# Altium schematic sheet Aixcel_Tiny_Recon_Board_Page1.SchDoc
size A4; Organization: Altium Limited; Address1: L3, 12a Rodborough Rd; Address2: Frenchs Forest; Address3: NSW; Address4: Australia 2086; DocumentNumber: 01; Revision: 01; SheetNumber: 3; SheetTotal: 4
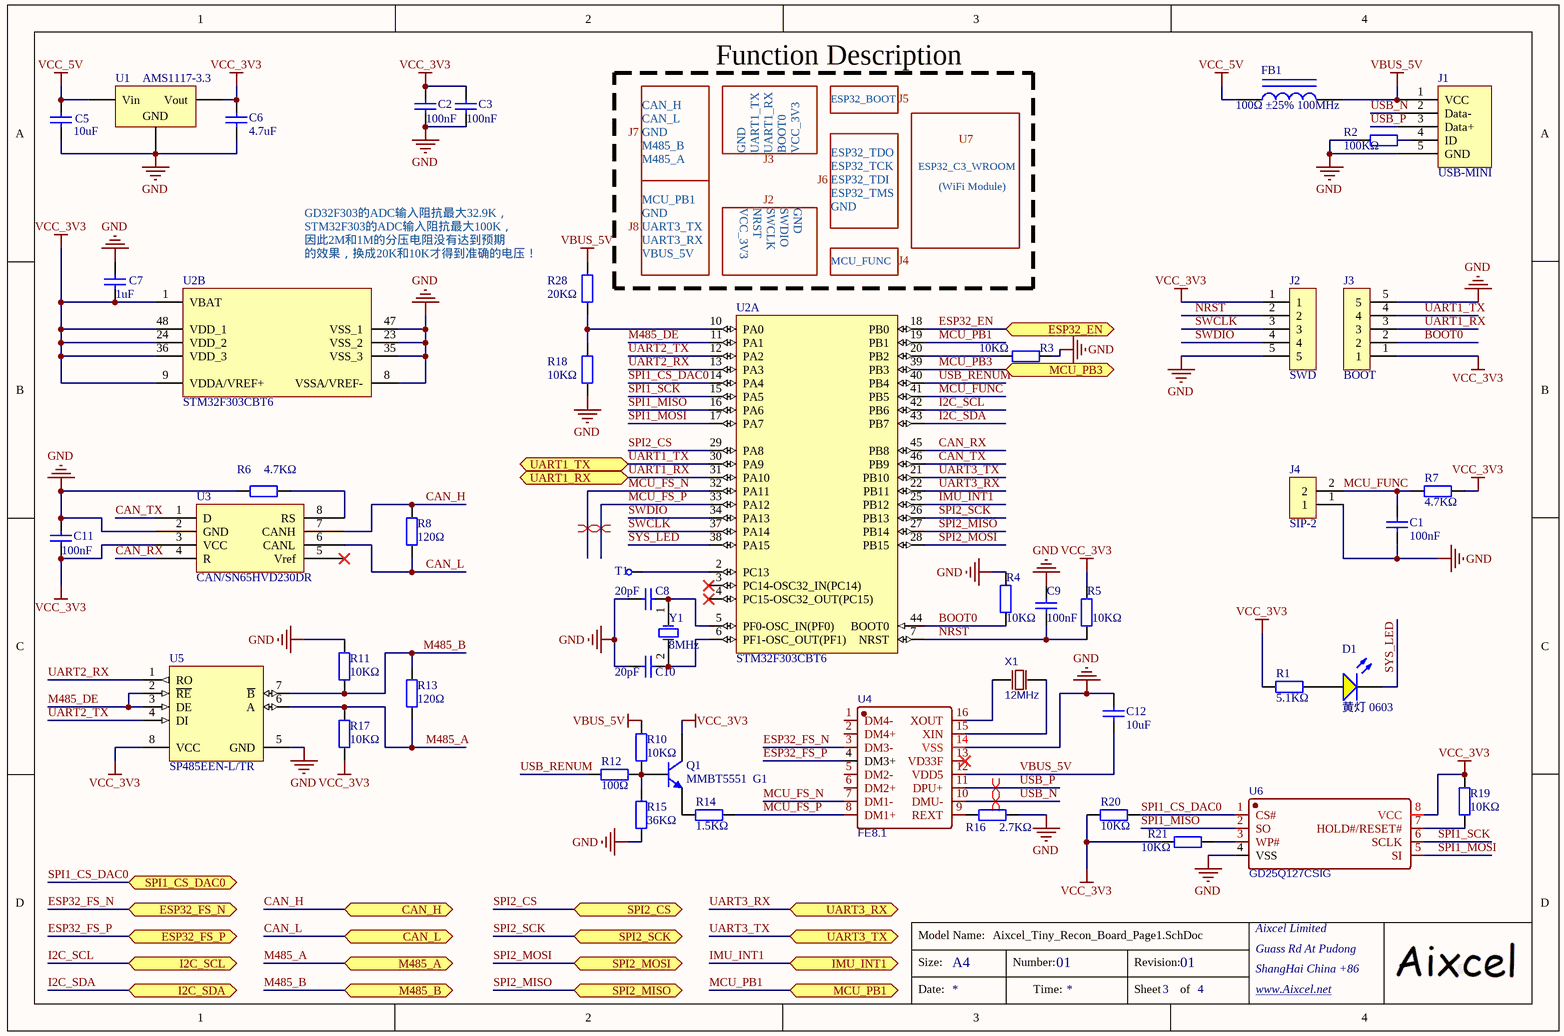
[diagram p0: Aixcel_Tiny_Recon_Board_Page1.SchDoc]

## Parts
C1  100nF  [0603_C]
C2  100nF  [0603_C]
C3  100nF  [0603_C]
C5  10uF  [0603_C]
C6  4.7uF  [0603_C]
C7  1uF  [0603_C]
C8  20pF  [0603_C]
C9  100nF  [0603_C]
C10  20pF  [0603_C]
C11  100nF  [0603_C]
C12  10uF  [0603_C]
D1  黄灯 0603  [0603_LED_S1]
FB1  100Ω ±25% 100MHz  [0805_L]
J1  USB-MINI  [USB-MINI贴片]
J2  SWD  [ZH1.5-WS-5P]
J3  BOOT  [ZH1.5-WS-5P]
J4  SIP-2  [TSW SMD-3*6*2.5]
Q1  MMBT5551  G1  [SOT-23(SOT-23-3)]
R1  5.1KΩ  [0603_R]
R2  100KΩ  [0603_R]
R3  10KΩ  [0603_R]
R4  10KΩ  [0603_R]
R5  10KΩ  [0603_R]
R6  4.7KΩ  [0603_R]
R7  4.7KΩ  [0603_R]
R8  120Ω  [0603_R]
R10  10KΩ  [0603_R]
R11  10KΩ  [0603_R]
R12  100Ω  [0603_R]
R13  120Ω  [0603_R]
R14  1.5KΩ  [0603_R]
R15  36KΩ  [0603_R]
R16  2.7KΩ  [0603_R]
R17  10KΩ  [0603_R]
R18  10KΩ  [0603_R]
R19  10KΩ  [0603_R]
R20  10KΩ  [0603_R]
R21  10KΩ  [0603_R]
R28  20KΩ  [0603_R]
T1  CHECK  [CHECK-C]  (value not drawn)
U1  AMS1117-3.3  [SOT-223]
U2  STM32F303CBT6  [STM-LQFP48_L]  (parts A,B of 2)
U3  CAN/SN65HVD230DR  [SOIC-8_150mil]
U4  FE8.1  [SSOP-16_L4.9-W3.9-P0.64-LS6.0-BL]
U5  SP485EEN-L/TR  [SOIC-8_150mil]
U6  GD25Q127CSIG  [GD25Q127CSIG]
X1  12MHz  [12MHz]
Y1  8MHz  [SMD-5032_2P]

## Ports
CAN_H (bidir), CAN_L (bidir), ESP32_EN (bidir), ESP32_FS_N (bidir), ESP32_FS_P (bidir), I2C_SCL (bidir), I2C_SDA (bidir), IMU_INT1 (bidir), M485_A (bidir), M485_B (bidir), MCU_PB1 (bidir), MCU_PB3 (bidir), SPI1_CS_DAC0 (bidir), SPI2_CS (bidir), SPI2_MISO (bidir), SPI2_MOSI (bidir), SPI2_SCK (bidir), UART1_RX (bidir), UART1_TX (bidir), UART3_RX (bidir), UART3_TX (bidir)

## Nets
GND: C1.1 C2.2 C3.2 C5.1 C6.1 C7.2 C8.1 C9.2 C10.1 C11.2 C12.2 J1.5(GND) J2.5 J3.5 J4.1 R2.1 R3.1 R4.2 R6.1 R11.2 R15.1 R16.2 R18.1 U1.1(GND) U2.8(VSSA/VREF-) U2.23(VSS_2) U2.35(VSS_3) U2.47(VSS_1) U3.2(GND) U4.14(VSS) U5.5(GND) U6.4(VSS)
VBUS_5V: C12.1 FB1.2 J1.1(VCC) R10.2 R28.2 U4.12(VDD5)
VCC_3V3: C2.1 C3.1 C6.2 C7.1 C11.1 J2.1 J3.1 Q1.3(C) R1.1 R5.2 R7.2 R17.1 R19.1 R20.1 R21.2 U1.2(Vout) U2.1(VBAT) U2.9(VDDA/VREF+) U2.24(VDD_2) U2.36(VDD_3) U2.48(VDD_1) U3.3(VCC) U5.8(VCC) U6.8(VCC)
VCC_5V: C5.2 FB1.1 U1.3(Vin)
BOOT0: J3.2 R4.1 U2.44(BOOT0)
CAN_H: R8.2 U3.7(CANH) ; port CAN_H
CAN_L: R8.1 U3.6(CANL) ; port CAN_L
CAN_RX: U2.45(PB8) U3.4(R)
CAN_TX: U2.46(PB9) U3.1(D)
ESP32_EN: U2.18(PB0) ; port ESP32_EN
ESP32_FS_N: U4.3(DM3-) ; port ESP32_FS_N
ESP32_FS_P: U4.4(DM3+) ; port ESP32_FS_P
I2C_SCL: U2.42(PB6) ; port I2C_SCL
I2C_SDA: U2.43(PB7) ; port I2C_SDA
IMU_INT1: U2.25(PB12) ; port IMU_INT1
M485_A: R13.1 R17.2 U5.6(A) ; port M485_A
M485_B: R11.1 R13.2 U5.7(~{B}) ; port M485_B
M485_DE: U2.11(PA1) U5.2(~{RE}) U5.3(DE)
MCU_FS_N: U2.32(PA11) U4.7(DM1-)
MCU_FS_P: R14.1 U2.33(PA12) U4.8(DM1+)
MCU_FUNC: C1.2 J4.2 R7.1 U2.41(PB5)
MCU_PB1: U2.19(PB1) ; port MCU_PB1
MCU_PB3: U2.39(PB3) ; port MCU_PB3
NRST: C9.1 J2.2 R5.1 U2.7(NRST)
SPI1_CS_DAC0: R20.2 U2.14(PA4) U6.1(CS#) ; port SPI1_CS_DAC0
SPI1_MISO: U2.16(PA6) U6.2(SO)
SPI1_MOSI: U2.17(PA7) U6.5(SI)
SPI1_SCK: U2.15(PA5) U6.6(SCLK)
SPI2_CS: U2.29(PA8) ; port SPI2_CS
SPI2_MISO: U2.27(PB14) ; port SPI2_MISO
SPI2_MOSI: U2.28(PB15) ; port SPI2_MOSI
SPI2_SCK: U2.26(PB13) ; port SPI2_SCK
SWCLK: J2.3 U2.37(PA14)
SWDIO: J2.4 U2.34(PA13)
SYS_LED: D1.K U2.38(PA15)
UART1_RX: J3.3 U2.31(PA10) ; port UART1_RX
UART1_TX: J3.4 U2.30(PA9) ; port UART1_TX
UART2_RX: U2.13(PA3) U5.1(RO)
UART2_TX: U2.12(PA2) U5.4(DI)
UART3_RX: U2.22(PB11) ; port UART3_RX
UART3_TX: U2.21(PB10) ; port UART3_TX
USB_N: J1.2(Data-) U4.10(DMU-)
USB_P: J1.3(Data+) U4.11(DPU+)
USB_RENUM: R12.1 U2.40(PB4)
NetC8_2: C8.2 U2.5(PF0-OSC_IN(PF0)) Y1.1(OSC1)
NetC10_2: C10.2 U2.6(PF1-OSC_OUT(PF1)) Y1.2(OSC2)
NetD1_A: D1.A R1.2
NetJ1_4: J1.4(ID) R2.2
NetQ1_1: Q1.1(B) R10.1 R12.2 R15.2
NetQ1_2: Q1.2(E) R14.2
NetR3_2: R3.2 U2.20(PB2)
NetR6_2: R6.2 U3.8(RS)
NetR16_1: R16.1 U4.9(REXT)
NetR18_2: R18.2 R28.1 U2.10(PA0)
NetR19_2: R19.2 U6.7(HOLD#/RESET#)
NetR21_1: R21.1 U6.3(WP#)
NetT1_1: T1.1 U2.2(PC13)
NetU4_15: U4.15(XIN) X1.2(OSC2)
NetU4_16: U4.16(XOUT) X1.1(OSC1)

Not connected (* = marked no-connect by the designer): U2 3(PC14-OSC32_IN(PC14))* 4(PC15-OSC32_OUT(PC15))*; U3 5(Vref)*; U4 1(DM4-) 2(DM4+) 5(DM2-) 6(DM2+) 13(VD33F)*

## Layout directives
differential pair: MCU_FS_N, MCU_FS_P, USB_N, USB_P

## Notes on the sheet
- CAN_H
- Function Description
- ESP32_BOOT
- J5
- J7
- M485_A
- M485_B
- CAN_L
- GND
- J3
- UART1_TX
- UART1_RX
- BOOT0
- VCC_3V3
- ESP32_TDO
- ESP32_TCK
- ESP32_C3_WROOM
- U7
- GD32F303的ADC输入阻抗最大32.9K，
- STM32F303的ADC输入阻抗最大100K，
- 因此2M和1M的分压电阻没有达到预期
- J8
- UART3_RX
- UART3_TX
- MCU_PB1
- NRST
- J2
- SWCLK
- SWDIO
- J6
- ESP32_TDI
- ESP32_TMS
- (WiFi Module)
- (near U2) 的效果，换成20K和10K才得到准确的电压！
- VBUS_5V
- MCU_FUNC
- J4
- Size:
- Model Name:
- A4
- Number:
- Revision:
- Aixcel Limited
- Guass Rd At Pudong
- ShangHai China +86
- Date:
- Time:
- Sheet
- of
- www.Aixcel.net <http://www.Aixcel.net>

## Library data of the parts
C1-C3 C9 C11 = 0603 100nF (104) 10% 50V: 贴片电容; ComponentLink1Description: 供应商链接; ComponentLink1URL: http://www.szlcsc.com/product/details_15331.html; Package: 0603; Supplier: LC; SuppliersPartNumber: C14663
C5 C12 = 0603 10uF (106) 10% 10V: 贴片电容; ComponentLink1Description: 供应商链接; ComponentLink1URL: http://www.szlcsc.com/product/details_20411.html; Package: 0603; Supplier: LC; SuppliersPartNumber: C19702
C6 = 0603 4.7uF (475) 10% 16V: 贴片电容; ComponentLink1Description: 供应商链接; ComponentLink1URL: http://www.szlcsc.com/product/details_20375.html; Package: 0603; Supplier: LC; SuppliersPartNumber: C19666
C7 = 0603 1uF (105) 10% 50V: 贴片电容; ComponentLink1Description: 供应商链接; ComponentLink1URL: http://www.szlcsc.com/product/details_16531.html; Package: 0603; Supplier: LC; SuppliersPartNumber: C15849
C8 C10 = 0603 20pF (200) 5% 50V: 贴片电容; ComponentLink1Description: 供应商链接; ComponentLink1URL: http://www.szlcsc.com/product/details_2000.html; Package: 0603; Supplier: LC; SuppliersPartNumber: C1648
D1 = 0603 黄灯: 发光二极管; ComponentLink1Description: 供应商链接; ComponentLink1URL: http://www.szlcsc.com/product/details_73147.html; Package: 0603; Supplier: LC; SuppliersPartNumber: C72038
FB1 = 0805 100Ω 25% 100MHz: 贴片磁珠; ComponentLink1Description: 供应商链接; ComponentLink1URL: http://www.szlcsc.com/product/details_1367.html; Package: 0805; Supplier: LC; SuppliersPartNumber: C1015
J2 J3 = SIP-5
Q1 = SOT-23 MMBT5551  G1: 三极管; ComponentLink1Description: 供应商链接; ComponentLink1URL: http://www.szlcsc.com/product/details_2502.html; Package: SOT-23; Supplier: LC; SuppliersPartNumber: C2145
R1 = 0603 5.1KΩ (5101) 1%: 贴片电阻; ComponentLink1Description: 供应商链接; ComponentLink1URL: http://www.szlcsc.com/product/details_23913.html; Package: 0603; Supplier: LC; SuppliersPartNumber: C23186
R2 = 0603 100KΩ (1003) 1%: 贴片电阻; ComponentLink1Description: 供应商链接; ComponentLink1URL: http://www.szlcsc.com/product/details_26546.html; Package: 0603; Supplier: LC; SuppliersPartNumber: C25803
R3-R5 R10 R11 R17-R21 = 0603 10KΩ (1002) 1%: 贴片电阻; ComponentLink1Description: 供应商链接; ComponentLink1URL: http://www.szlcsc.com/product/details_26547.html; Package: 0603; Supplier: LC; SuppliersPartNumber: C25804
R6 R7 = 0603 4.7KΩ (4701) 1%: 贴片电阻; ComponentLink1Description: 供应商链接; ComponentLink1URL: http://www.szlcsc.com/product/details_23889.html; Package: 0603; Supplier: LC; SuppliersPartNumber: C23162
R8 R13 = 0603 120Ω (1200) 1%: 贴片电阻; ComponentLink1Description: 供应商链接; ComponentLink1URL: http://www.szlcsc.com/product/details_23514.html; Package: 0603; Supplier: LC; SuppliersPartNumber: C22787
R12 = 0603 100Ω (1000) 1%: 贴片电阻; ComponentLink1Description: 供应商链接; ComponentLink1URL: http://www.szlcsc.com/product/details_23502.html; Package: 0603; Supplier: LC; SuppliersPartNumber: C22775
R14 = 0603 1.5KΩ (1501) 1%: 贴片电阻; ComponentLink1Description: 供应商链接; ComponentLink1URL: http://www.szlcsc.com/product/details_23570.html; Package: 0603; Supplier: LC; SuppliersPartNumber: C22843
R15 = 0603 36KΩ (3602) 1%: 贴片电阻; ComponentLink1Description: 供应商链接; ComponentLink1URL: http://www.szlcsc.com/product/details_23874.html; Package: 0603; Supplier: LC; SuppliersPartNumber: C23147
R16 = 0603 2.7KΩ (2701) 1%: 贴片电阻; ComponentLink1Description: 供应商链接; ComponentLink1URL: http://www.szlcsc.com/product/details_13814.html; Package: 0603; Supplier: LC; SuppliersPartNumber: C13167
R28 = 0603 20KΩ (2002) 1%: 贴片电阻; ComponentLink1Description: 供应商链接; ComponentLink1URL: http://www.szlcsc.com/product/details_4591.html; Package: 0603; Supplier: LC; SuppliersPartNumber: C4184
T1 = CHECK: 测试点
U1 = SOT-223 AMS1117-3.3: 低压差线性稳压(LDO); ComponentLink1Description: 供应商链接; ComponentLink1URL: http://www.szlcsc.com/product/details_6652.html; Package: SOT-223; Supplier: LC; SuppliersPartNumber: C6186
U2 = STM32F303CBT6: ARM Cortex-M4 32-bit MCU, 128 KB Flash, 32 KB Internal RAM, 37 I/Os, 48-pin LQFP, -40 to 85 degC, Tray; D/A Converter: 2x12-bit (2 Channel); FLASH Size (Prog) (kB): 128; I/Os (High Current): 37; Internal RAM Size (kB): 32; Operating Frequency(F) (Processor speed) (MHz): 72; Supply Voltage(Vcc) min (V): 2; DatasheetVersion: Rev. 6; PackageVersion: Rev. 6, 06/2013; PackageReference: LQFP48; PackageDescription: 48-Pin Low Profile Quad Flat Package, 7 x 7 mm Body, 0.5 mm Pitch; Supplier 1: Digi-Key; Supplier Part Number 1: STM32F303CBT6-ND; Supplier 2: Newark; Supplier Part Number 2: 99W9871; Supplier 3: Newark; Supplier Part Number 3: 66W7285; Core: ARM Cortex-M4; Packing: Tray; Mounting Technology: Surface Mount; PartNumber: STM32F303CBT6; ComponentLink1Description: Manufacturer URL; ComponentLink1URL: http://www.st.com/web/en/home.html; ComponentLink2Description: Datasheet; ComponentLink2URL: http://www.st.com/st-web-ui/static/active/en/resource/technical/document/datasheet/DM00058181.pdf; ComponentLink3Description: Package Specification; ComponentLink3URL: http://www.st.com/st-web-ui/static/active/en/resource/technical/document/datasheet/DM00058181.pdf
U3 = CAN/SN65HVD230DR_[C12084]: CAN; ComponentLink1Description: 供应商链接; ComponentLink1URL: http://www.szlcsc.com/product/details_12661.html; Package: SOIC-8_150mil; Supplier: LC; SuppliersPartNumber: C12084
U4 = FE8.1: Contributor: 私有工程; SMT Type: Extend; BOM_Supplier: zhqsoft; BOM_LCSC Assembly: Yes; spicePre: U; spiceSymbolName: FE8.1
U5 = SP485EEN-L/TR_[C6855]: RS-485/RS-422; ComponentLink1Description: 供应商链接; ComponentLink1URL: http://www.szlcsc.com/product/details_7327.html; Package: SOIC-8; Supplier: LC; SuppliersPartNumber: C6855
U6 = GD25Q127CSIG: BOM_Manufacturer: GigaDevice; BOM_Paste Type: expand; BOM_Supplier: LCSC; BOM_Manufacturer Part: GD25Q127CSIG; BOM_Supplier Part: C79079; spicePre: U; spiceSymbolName: GD25Q127CSIG
X1 = 12MHz: BOM_Manufacturer: YXC; BOM_Manufacturer Part: X503212MSD2GC; nameAlias: Frequency; BOM_Supplier Part: C33728; BOM_Supplier: LCSC; BOM_JLCPCB Part Class: Extended Part; spicePre: X; spiceSymbolName: X503212MSD2GC
Y1 = SMD-5032_2P 8MHz 20ppm 20pF: 贴片晶振; ComponentLink1Description: 供应商链接; ComponentLink1URL: http://www.szlcsc.com/product/details_117214.html; Package: SMD-5032_2P; Supplier: LC; SuppliersPartNumber: C115962